# Altium schematic sheet Servos_controller.SchDoc
size A4; SheetNumber: 8; SheetTotal: 10
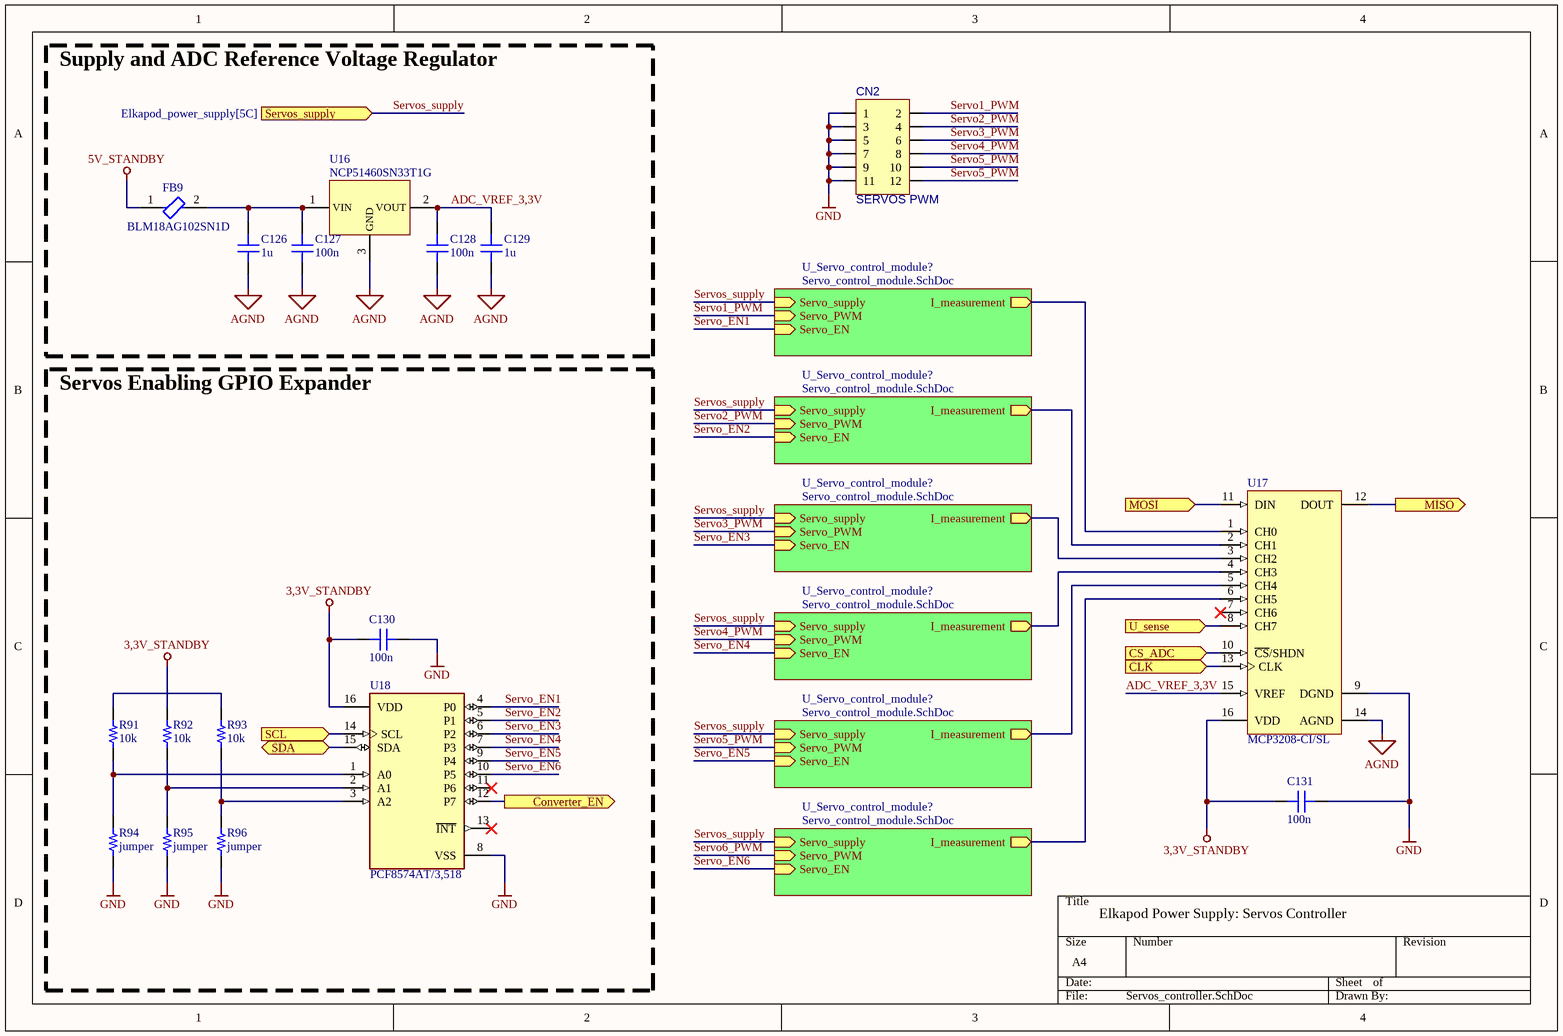
[diagram p0: Servos_controller.SchDoc]

## Parts
C126  1u  [CAP 0603_1608]
C127  100n  [CAP 0603_1608]
C128  100n  [CAP 0603_1608]
C129  1u  [CAP 0603_1608]
C130  100n  [CAP 0603_1608]
C131  100n  [CAP 0603_1608]
CN2  SERVOS PWM  [IDC12]
FB9  BLM18AG102SN1D  [FP-BLM18-0_15-t0_8-MFG]
R91  10k  [RES 0603_1608]
R92  10k  [RES 0603_1608]
R93  10k  [RES 0603_1608]
R94  value jumper  [RES 0603_1608]  (hidden comment: A0_jumper)
R95  value jumper  [RES 0603_1608]  (hidden comment: A1_jumper)
R96  value jumper  [RES 0603_1608]  (hidden comment: A2_jumper)
U16  NCP51460SN33T1G  [SOT23-3]
U17  MCP3208-CI/SL  [SOIC-SL16_M]
U18  PCF8574AT/3,518  [FP-SOT162-1-MFG]

## Blocks framed on the sheet
Supply and ADC Reference Voltage Regulator: C126-C129 FB9 U16
Servos Enabling GPIO Expander: C130 R91-R96 U18

## Sub-sheets
U_Servo_control_module? = Servo_control_module.SchDoc: Servo_supply (in), Servo_PWM (in), I_measurement (out), Servo_EN (in)
U_Servo_control_module? = Servo_control_module.SchDoc: Servo_supply (in), Servo_PWM (in), I_measurement (out), Servo_EN (in)
U_Servo_control_module? = Servo_control_module.SchDoc: Servo_supply (in), Servo_PWM (in), I_measurement (out), Servo_EN (in)
U_Servo_control_module? = Servo_control_module.SchDoc: Servo_supply (in), Servo_PWM (in), I_measurement (out), Servo_EN (in)
U_Servo_control_module? = Servo_control_module.SchDoc: Servo_supply (in), Servo_PWM (in), I_measurement (out), Servo_EN (in)
U_Servo_control_module? = Servo_control_module.SchDoc: Servo_supply (in), Servo_PWM (in), I_measurement (out), Servo_EN (in)

## Ports
CLK (in, see Elkapod_power_supply[5C]), Converter_EN (out, see Elkapod_power_supply[5C]), CS_ADC (in, see Elkapod_power_supply[5C]), MISO (out, see Elkapod_power_supply[5C], Logic_controller[1D]), MOSI (in, see Elkapod_power_supply[5C], Logic_controller[1D]), SCL (in, see Elkapod_power_supply[5C], Controllable_voltage_outputs[2A], Electronics_power_supply_DC_converter[7C], Logic_controller[1D], Servos_DC_converter[5A]), SDA (bidir, see Elkapod_power_supply[5C], Controllable_voltage_outputs[2B], Electronics_power_supply_DC_converter[7C], Logic_controller[1D], Servos_DC_converter[5A]), Servos_supply (in, see Elkapod_power_supply[5C]), U_sense (in, see Elkapod_power_supply[5C])

## Nets
3,3V_STANDBY: C130.2 C131.2 R92.1 U17.16(VDD) U18.16(VDD)
5V_STANDBY: FB9.1
AGND: C126.1 C127.1 C128.1 C129.1 U16.3(GND) U17.14(AGND)
GND: C130.1 C131.1 CN2.1 CN2.3 CN2.5 CN2.7 CN2.9 CN2.11 R94.2 R95.2 R96.2 U17.9(DGND) U18.8(VSS)
ADC_VREF_3,3V: C128.2 C129.2 U16.2(VOUT) U17.15(VREF)
CLK: U17.13(CLK) ; port CLK
Converter_EN: U18.12(P7) ; port Converter_EN
CS_ADC: U17.10(~{CS}/SHDN) ; port CS_ADC
MISO: U17.12(DOUT) ; port MISO
MOSI: U17.11(DIN) ; port MOSI
SCL: U18.14(SCL) ; port SCL
SDA: U18.15(SDA) ; port SDA
Servo1_PWM: CN2.2 ; sheet U_Servo_control_module?/Servo_PWM
Servo2_PWM: CN2.4 ; sheet U_Servo_control_module?/Servo_PWM
Servo3_PWM: CN2.6 ; sheet U_Servo_control_module?/Servo_PWM
Servo4_PWM: CN2.8 ; sheet U_Servo_control_module?/Servo_PWM
Servo5_PWM: CN2.10 CN2.12 ; sheet U_Servo_control_module?/Servo_PWM
Servo6_PWM: sheet U_Servo_control_module?/Servo_PWM
Servo_EN1: U18.4(P0) ; sheet U_Servo_control_module?/Servo_EN
Servo_EN2: U18.5(P1) ; sheet U_Servo_control_module?/Servo_EN
Servo_EN3: U18.6(P2) ; sheet U_Servo_control_module?/Servo_EN
Servo_EN4: U18.7(P3) ; sheet U_Servo_control_module?/Servo_EN
Servo_EN5: U18.9(P4) ; sheet U_Servo_control_module?/Servo_EN
Servo_EN6: U18.10(P5) ; sheet U_Servo_control_module?/Servo_EN
Servos_supply: port Servos_supply, sheet U_Servo_control_module?/Servo_supply, sheet U_Servo_control_module?/Servo_supply, sheet U_Servo_control_module?/Servo_supply, sheet U_Servo_control_module?/Servo_supply, sheet U_Servo_control_module?/Servo_supply, sheet U_Servo_control_module?/Servo_supply
U_sense: U17.8(CH7) ; port U_sense
NetC126_2: C126.2 C127.2 FB9.2 U16.1(VIN)
NetR91_1: R91.1 R93.1
NetR91_2: R91.2 R94.1 U18.1(A0)
NetR92_2: R92.2 R95.1 U18.2(A1)
NetR93_2: R93.2 R96.1 U18.3(A2)
NetU17_1: U17.1(CH0) ; sheet U_Servo_control_module?/I_measurement
NetU17_2: U17.2(CH1) ; sheet U_Servo_control_module?/I_measurement
NetU17_3: U17.3(CH2) ; sheet U_Servo_control_module?/I_measurement
NetU17_4: U17.4(CH3) ; sheet U_Servo_control_module?/I_measurement
NetU17_5: U17.5(CH4) ; sheet U_Servo_control_module?/I_measurement
NetU17_6: U17.6(CH5) ; sheet U_Servo_control_module?/I_measurement

Not connected (* = marked no-connect by the designer): U17 7(CH6)*; U18 11(P6)* 13(~{INT})*

## Notes on the sheet
- Elkapod Power Supply: Servos Controller

## Library data of the parts
C126 C129 = C0603C272F3GAC7867: CAP CER 1uF 16V X5R 0603; manufacturer: KEMET; Temperature Coefficient: C0G, NP0; Tolerance: ±1%; Voltage - Rated: 25V; Part Number: C0603C272F3GAC7867; Value: 1u; Applications: General Purpose; Capacitance: 1u; componentlink1description: Datasheet; componentlink1url: https://api.kemet.com/component-edge/download/datasheet/C0603C272F3GACTU.pdf; componentlink2description: DigiKey Link; componentlink2url: https://www.digikey.com/en/products/detail/kemet/C0603C272F3GAC7867/2200413; Device Package: 0603 (1608 Metric); Features: Low ESL; lastupdated: 09.02.2024 20:10:30; Lifecycle Status: Active; Minimum Order: 1; Mounting Type: Surface Mount, MLCC; Operating Temperature: -55°C ~ 125°C; Package / Case: 0603 (1608 Metric); packaging: TapeAndReel; partid: 2138; Part Status: Active; price: 0.40; series: SMD Comm C0G; Size / Dimension: 0.063" L x 0.031" W (1.60mm x 0.80mm); Thickness (Max): 0.034" (0.87mm)
C127 C128 C130 C131 = C0603C272F3GAC7867: CAP CER 100nF 25V X5R 0603; manufacturer: KEMET; Temperature Coefficient: C0G, NP0; Tolerance: ±1%; Part Number: C0603C272F3GAC7867; Value: 100n; Applications: General Purpose; Capacitance: 100n; componentlink1description: Datasheet; componentlink1url: https://api.kemet.com/component-edge/download/datasheet/C0603C272F3GACTU.pdf; componentlink2description: DigiKey Link; componentlink2url: https://www.digikey.com/en/products/detail/kemet/C0603C272F3GAC7867/2200413; Device Package: 0603 (1608 Metric); Features: Low ESL; lastupdated: 09.02.2024 20:10:30; Lifecycle Status: Active; Minimum Order: 1; Mounting Type: Surface Mount, MLCC; Operating Temperature: -55°C ~ 125°C; Package / Case: 0603 (1608 Metric); packaging: TapeAndReel; partid: 2138; Part Status: Active; price: 0.40; series: SMD Comm C0G; Size / Dimension: 0.063" L x 0.031" W (1.60mm x 0.80mm); Thickness (Max): 0.034" (0.87mm); Voltage - Rated: 25V
CN2 = CN_6x2
FB9 = CMP-0686-00457-3: Chip Ferrite Bead, 0603, 1000Ω @ 100MHz, 0.5Ω, 25%, 450mA; Number of Circuits: 1; Max DC Current: 400mA; Shielding: Unshielded; DC Resistance (DCR): 500mR; Material: Steel; DC Resistance-Max: 700mR; Impedance: 1kR; Case Code (Imperial): 0603; Max Current Rating: 400mA; Frequency: 100MHz; Min Operating Temperature: -55°C; Case/Package: 0603; Depth: 0.8mm; Lead Free: Lead Free; Core Material: Ferrite; Current Rating: 400mA; Resistance: 500mR; Case Code (Metric): 1608; DC Current: 400mA; Package Quantity: 1; Packaging: Tape and Reel; Width: 0.8mm; Military Standard: Not; Height: 0.8mm; Series: BLM18A; Max Operating Temperature: 125°C; Tolerance: 25%; Termination: SMD/SMT; Test Frequency: 100MHz; Number of Lines: 1; Number of Pins: 2; REACH SVHC: No SVHC; Length: 1.6mm; Radiation Hardening: No
R91-R93 = RNCS0603BKE10K0: RES 10K OHM 1% 0,1W 0603; Manufacturer: Stackpole Electronics Inc; Power (Watts): 0.063W, 1/16W; Temperature Coefficient: ±25ppm/°C; Tolerance: ±0.1%; Part Number: RNCS0603BKE10K0; Value: 10k; Composition: Thin Film; Device Package: 0603 (1608 Metric); Features: Anti-Corrosive, Automotive AEC-Q200, Moisture Resistant; Height - Seated (Max): 0.022" (0.55mm); LastUpdated: 09.02.2024 20:43:37; Lifecycle Status: Active; Minimum Order: 1; Number of Terminations: 2; Operating Temperature: -55°C ~ 155°C; Package / Case: 0603 (1608 Metric); Packaging: TapeAndReel; PartId: 4838; Part Status: Active; Price: 0.06; Ratings: AEC-Q200; Resistance: 10k; Series: RNCS; Size / Dimension: 0.061" L x 0.031" W (1.55mm x 0.80mm); Supplier Device Package: 0603
R94-R96 = RNCS0603BKE10K0: RES 0 OHM 1% 0,1W 0603; Manufacturer: Stackpole Electronics Inc; Power (Watts): 0.063W, 1/16W; Resistance: 0; Temperature Coefficient: ±25ppm/°C; Tolerance: ±0.1%; Part Number: RNCS0603BKE10K0; Composition: Thin Film; Device Package: 0603 (1608 Metric); Features: Anti-Corrosive, Automotive AEC-Q200, Moisture Resistant; Height - Seated (Max): 0.022" (0.55mm); LastUpdated: 09.02.2024 20:43:37; Lifecycle Status: Active; Minimum Order: 1; Number of Terminations: 2; Operating Temperature: -55°C ~ 155°C; Package / Case: 0603 (1608 Metric); Packaging: TapeAndReel; PartId: 4838; Part Status: Active; Price: 0.06; Ratings: AEC-Q200; Series: RNCS; Size / Dimension: 0.061" L x 0.031" W (1.55mm x 0.80mm); Supplier Device Package: 0603
U16 = NCP51460SN33T1G: Low power precision voltage reference; Iout = 20mA
U17 = CMP-0188-00449-2: 2.7V 4-Channel/8-Channel 12-Bit A/D Converters with SPI Serial Interface, 16-Pin SOIC 150mil, C Performance Grade, Industrial Temperature; PackageVersion: revBB, Aug-2009; ComponentLink2Description: Datasheet; Code_JEDEC: MS-012-AC; Code_IPC: SOIC127P600-16; ComponentLink1Description: Manufacturer URL; ComponentLink3URL: http://www.microchip.com/stellent/groups/techpub_sg/documents/packagingspec/en012702.pdf; PackageDescription: 16-Lead Plastic Small Outline (SL) - Narrow, 3.90mm Body [SOIC]; PackageReference: SOIC-SL16; DatasheetVersion: revE, Sep-2008; RevisionNote: URLs added.; ComponentLink1URL: http://www.microchip.com/; ComponentLink3Description: Package Specification; ComponentLink2URL: http://ww1.microchip.com/downloads/en/DeviceDoc/21298e.pdf
U18 = CMP-10112-000003-1: IC I/O EXPANDER I2C 8B 16SOIC; Manufacturer: NXP Semiconductors; Interface: I2C,SMBus; Frequency: 100kHz; Nominal Supply Current: 40uA; Max Supply Voltage: 6V; Number Of I/Os: 8; Max Junction Temp: +125°C; Min Supply Voltage: 2.5V; Standoff Height: 0.1mm; RoHS: TRUE; Category: IC; Temperature: -40°C to +85°C; Device Class L3: I/O Expanders; ComponentLink2Description: Datasheet; ComponentLink2URL: https://www.nxp.com/docs/en/data-sheet/PCF8574_PCF8574A.pdf; Digikey Description: IC I/O EXPANDER I2C 8B 16SOIC; Ipc Land Pattern Name: SOIC127P1032X265-16; Mouser Description: PCF8574 Series 2.5 to 6V Remote 8-bit I/O Expander for I2C-bus -SOIC-16; Footprint Url: https://www.nxp.com/docs/en/package-information/SOT162-1.pdf; Lead Free: Yes; Device Class L2: Interface ICs; Ambient Temperature Range Low: -40°C; Temperature Range High: +85°C; Automotive: No; Manufacturer Part Number: PCF8574AT/3,518; Ambient Temperature Range High: +85°C; Height: 2.65mm; Package: SOT162-1; Temperature Range Low: -40°C; Octopart: https://octopart.com/pcf8574at%2F3%2C518-nxp+semiconductors-11541925; Device Class L1: Integrated Circuits (ICs)